# EAGLE schematic atmel_midi_clock (EAGLE 7.1.0)
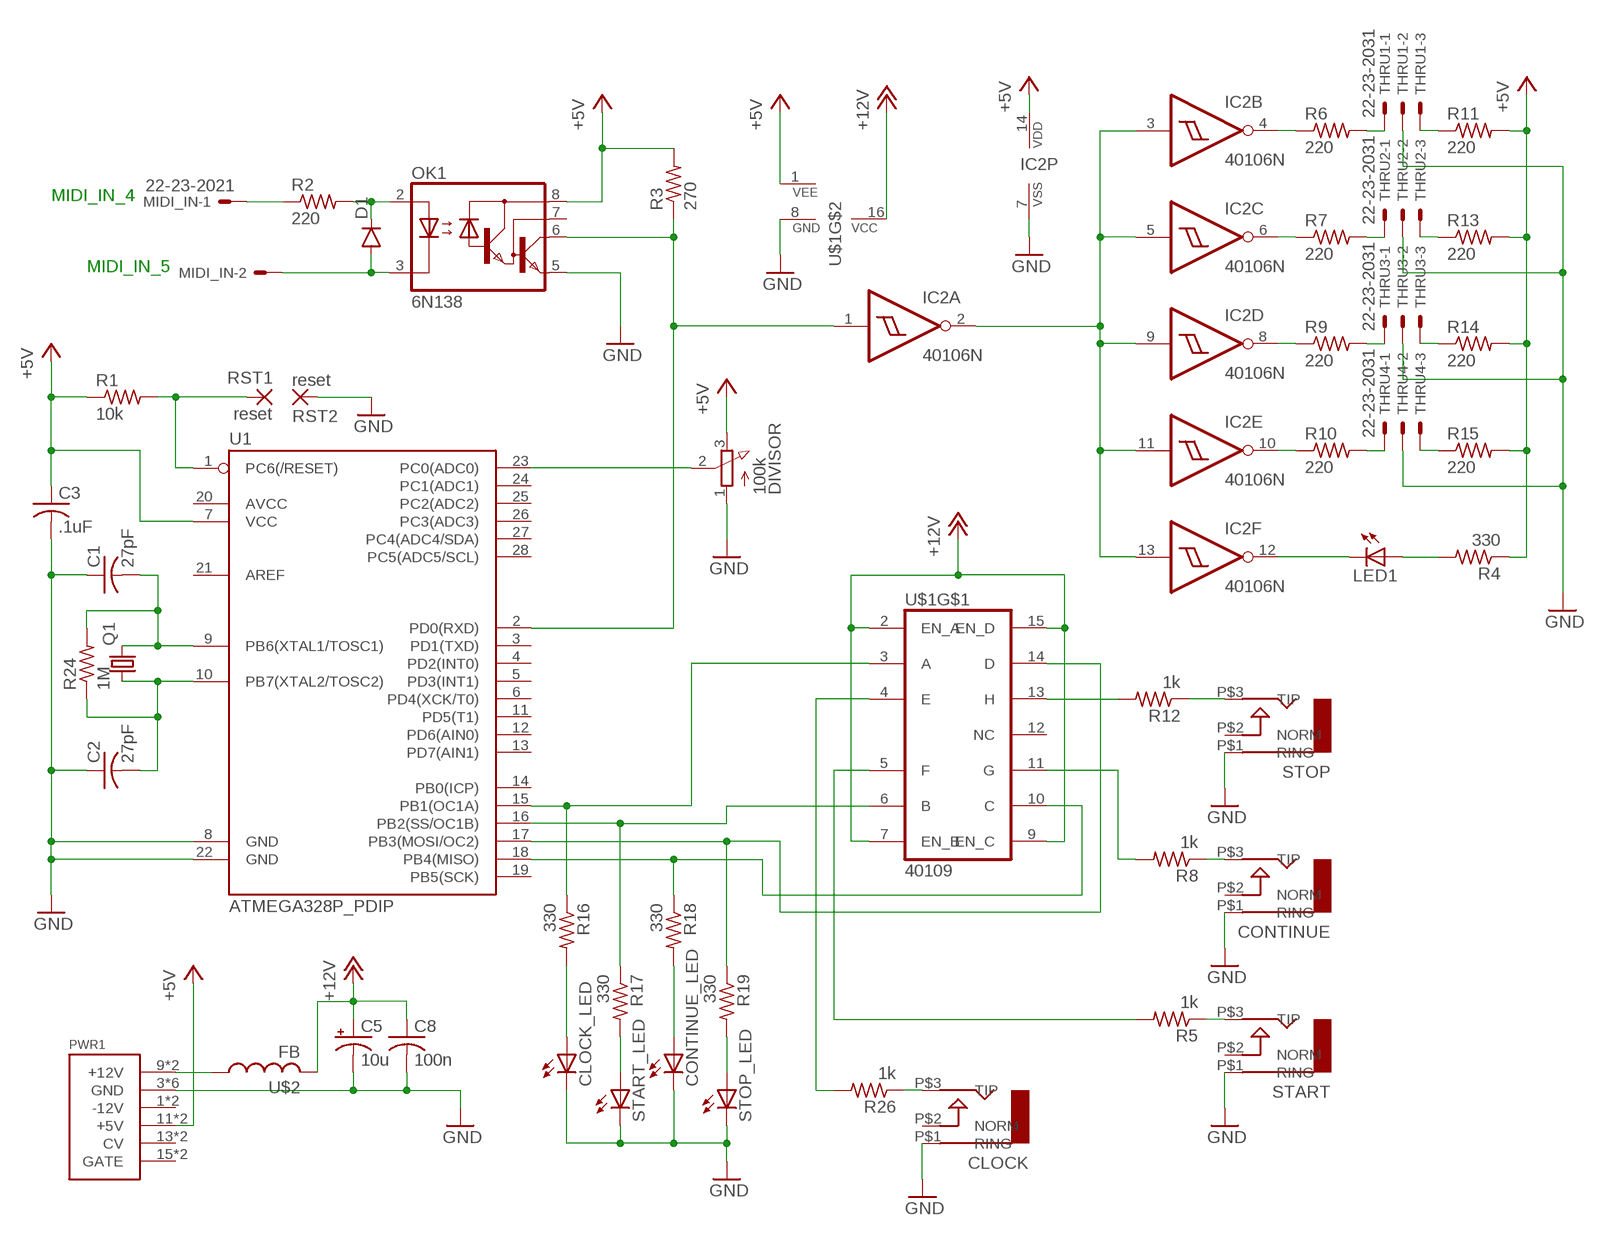
[diagram p0: schematic, sheet 1]

## Parts
C1  27pF  C-US025-040X050  [C025-040X050]
C2  27pF  C-US025-040X050  [C025-040X050]
C3  .1uF  C-US050-024X044  [C050-024X044]
C5  10u  CPOL-USB45181A  [B45181A]
C8  100n  C-US050-024X044  [C050-024X044]
CLOCK  AUDIO-JACK  [ERTHENVAR-JACK-90DEG]
CLOCK_LED  LED5MM  [LED5MM]
CONTINUE  AUDIO-JACK  [ERTHENVAR-JACK-90DEG]
CONTINUE_LED  LED5MM  [LED5MM]
D1  DIODE1N4148  [DIODE-1N4148]
DIVISOR  100k  3RP/1610N  [3RP/1610N]
IC2  40106N  [DIL14]
LED1  LED5MM  [LED5MM]
MIDI_IN  22-23-2021  [22-23-2021]
OK1  6N138  [DIL08]
PWR1  POWER  [POWER_16]
Q1  CRYSTALHC49S  [HC49/S]
R1  10k  R-US_0207/10  [0207/10]
R2  220  R-US_0207/10  [0207/10]
R3  270  R-US_0207/10  [0207/10]
R4  330  R-US_0207/10  [0207/10]
R5  1k  R-US_0207/10  [0207/10]
R6  220  R-US_0207/10  [0207/10]
R7  220  R-US_0207/10  [0207/10]
R8  1k  R-US_0207/10  [0207/10]
R9  220  R-US_0207/10  [0207/10]
R10  220  R-US_0207/10  [0207/10]
R11  220  R-US_0207/10  [0207/10]
R12  1k  R-US_0207/10  [0207/10]
R13  220  R-US_0207/10  [0207/10]
R14  220  R-US_0207/10  [0207/10]
R15  220  R-US_0207/10  [0207/10]
R16  330  R-US_0207/10  [0207/10]
R17  330  R-US_0207/10  [0207/10]
R18  330  R-US_0207/10  [0207/10]
R19  330  R-US_0207/10  [0207/10]
R24  1M  R-US_0207/10  [0207/10]
R26  1k  R-US_0207/10  [0207/10]
RST1  reset  2,54/0,9  [2,54/0,9]
RST2  reset  2,54/0,9  [2,54/0,9]
START  AUDIO-JACK  [ERTHENVAR-JACK-90DEG]
START_LED  LED5MM  [LED5MM]
STOP  AUDIO-JACK  [ERTHENVAR-JACK-90DEG]
STOP_LED  LED5MM  [LED5MM]
THRU1  22-23-2031  [22-23-2031]
THRU2  22-23-2031  [22-23-2031]
THRU3  22-23-2031  [22-23-2031]
THRU4  22-23-2031  [22-23-2031]
U1  ATMEGA328P_PDIP  [DIL28-3]
U$1  40109  [DIL16]
U$2  FB  [FB]

## Nets
+5V: C3.1 DIVISOR.3(E) IC2.14(P:VDD) OK1.8(VCC) PWR1.11(+5V) PWR1.12(+5V) R1.1 R3.2 R4.1 R11.2 R13.2 R14.2 R15.2 U1.7(VCC) U$1.1(VEE)
+12V: C5.+ C8.1 U$1.2(EN_A) U$1.7(EN_B) U$1.9(EN_C) U$1.15(EN_D) U$1.16(VCC) U$2.P$2
GND: C1.1 C2.1 C3.2 C5.- C8.2 CLOCK.P$1(RING) CLOCK_LED.K(C) CONTINUE.P$1(RING) CONTINUE_LED.K(C) DIVISOR.1(A) IC2.7(P:VSS) OK1.5(GND) PWR1.3(GND) PWR1.4(GND) PWR1.5(GND) PWR1.6(GND) PWR1.7(GND) PWR1.8(GND) RST2.1(P) START.P$1(RING) START_LED.K(C) STOP.P$1(RING) STOP_LED.K(C) THRU1.2 THRU2.2 THRU3.2 THRU4.2 U1.8(GND) U1.22(GND) U$1.8(GND)
N$1: R18.1 U1.18(PB4(MISO)) U$1.10(C)
N$2: R5.1 START.P$3(TIP)
N$3: D1.A MIDI_IN.2 OK1.3(C)
N$4: C1.2 Q1.2 R24.2 U1.9(PB6(XTAL1/TOSC1))
N$5: C2.2 Q1.1 R24.1 U1.10(PB7(XTAL2/TOSC2))
N$6: R19.1 U1.17(PB3(MOSI/OC2)) U$1.14(D)
N$7: D1.C OK1.2(A) R2.2
N$8: MIDI_IN.1 R2.1
N$9: R16.1 U1.15(PB1(OC1A)) U$1.3(A)
N$10: R17.1 U1.16(PB2(SS/OC1B)) U$1.6(B)
N$11: PWR1.9(+12V) PWR1.10(+12V) U$2.P$1
N$12: R5.2 U$1.5(F)
N$13: CONTINUE.P$3(TIP) R8.1
N$14: R26.2 U$1.4(E)
N$15: R12.2 U$1.13(H)
N$16: R8.2 U$1.11(G)
N$17: IC2.2(A:O) IC2.3(B:I) IC2.5(C:I) IC2.9(D:I) IC2.11(E:I) IC2.13(F:I)
N$18: R12.1 STOP.P$3(TIP)
N$19: DIVISOR.2(S) U1.23(PC0(ADC0))
N$20: IC2.12(F:O) LED1.K(C)
N$21: LED1.A R4.2
N$22: IC2.4(B:O) R6.1
N$23: IC2.6(C:O) R7.1
N$24: IC2.8(D:O) R9.1
N$25: IC2.10(E:O) R10.1
N$26: R6.2 THRU1.1
N$27: R7.2 THRU2.1
N$28: R9.2 THRU3.1
N$30: IC2.1(A:I) OK1.6(VO) R3.1 U1.2(PD0(RXD))
N$31: CLOCK.P$3(TIP) R26.1
N$32: R10.2 THRU4.1
N$33: R11.1 THRU1.3
N$34: R13.1 THRU2.3
N$35: R14.1 THRU3.3
N$36: R15.1 THRU4.3
N$37: R17.2 START_LED.A
N$38: CLOCK_LED.A R16.2
N$39: CONTINUE_LED.A R18.2
N$40: R19.2 STOP_LED.A
N$43: R1.2 RST1.1(P) U1.1(PC6(/RESET))
Unconnected: CLOCK.P$2(NORM) CONTINUE.P$2(NORM) OK1.7(VB) PWR1.1(-12V) PWR1.2(-12V) PWR1.13(CV) PWR1.14(CV) PWR1.15(GATE) PWR1.16(GATE) START.P$2(NORM) STOP.P$2(NORM) U1.3(PD1(TXD)) U1.4(PD2(INT0)) U1.5(PD3(INT1)) U1.6(PD4(XCK/T0)) U1.11(PD5(T1)) U1.12(PD6(AIN0)) U1.13(PD7(AIN1)) U1.14(PB0(ICP)) U1.19(PB5(SCK)) U1.20(AVCC) U1.21(AREF) U1.24(PC1(ADC1)) U1.25(PC2(ADC2)) U1.26(PC3(ADC3)) U1.27(PC4(ADC4/SDA)) U1.28(PC5(ADC5/SCL)) U$1.12(NC)

## Notes on the sheet
- MIDI_IN_4
- MIDI_IN_5

## Library data of the parts
C1-C3 C8 = rcl:C-US: CAPACITOR, American symbol
C5 = rcl:CPOL-US: POLARIZED CAPACITOR, American symbol
CLOCK CONTINUE START STOP = erthenvar:AUDIO-JACK: Switching Mono 3.5mm Audio Jack from Erthenvar.
CLOCK_LED CONTINUE_LED LED1 START_LED STOP_LED = led:LED: LED OSRAM: - CHIPLED LG R971, LG N971, LY N971, LG Q971, LY Q971, LO R971, LY R971 LH N974, LH R974 LS Q976, LO Q976, LY Q976 LO Q996 - Hyper CHIPLED LW Q18S LB Q993, LB Q99A, LB R99A - SideLED LS A670, LO A670, LY A670, LG A670, LP A670 LB A673, LV A673, LT A673, LW A673 LH A674 LY A675 LS A676, LA A676, LO A676, LY A676, LW A676 LS A679, LY A679, LG A679 - Hyper Micro SIDELED® LS Y876, LA Y876, LO Y876, LY Y876 LT Y87S - SmartLED LW L88C, LW L88S LB L89C, LB L89S, LG L890 LS L89K, LO L89K, LY L89K LS L896, LA L896, LO L896, LY L896 - TOPLED LS T670, LO T670, LY T670, LG T670, LP T670 LSG T670, LSP T670, LSY T670, LOP T670, LYG T670 LG T671, LOG T671, LSG T671 LB T673, LV T673, LT T673, LW T673 LH T674 LS T676, LA T676, LO T676, LY T676, LB T676, LH T676, LSB T676, LW T676 LB T67C, LV T67C, LT T67C, LS T67K, LO T67K, LY T67K, LW E67C LS E67B, LA E67B, LO E67B, LY E67B, LB E67C, LV E67C, LT E67C LW T67C LS T679, LY T679, LG T679 LS T770, LO T770, LY T770, LG T770, LP T770 LB T773, LV T773, LT T773, LW T773 LH T774 LS E675, LA E675, LY E675, LS T675 LS T776, LA T776, LO T776, LY T776, LB T776 LHGB T686 LT T68C, LB T68C - Hyper Mini TOPLED® LB M676 - Mini TOPLED Santana® LG M470 LS M47K, LO M47K, LY M47K Source: http://www.osram.convergy.de LUXEON: - LUMILED® LXK2-PW12-R00, LXK2-PW12-S00, LXK2-PW14-U00, LXK2-PW14-V00 LXK2-PM12-R00, LXK2-PM12-S00, LXK2-PM14-U00 LXK2-PE12-Q00, LXK2-PE12-R00, LXK2-PE12-S00, LXK2-PE14-T00, LXK2-PE14-U00 LXK2-PB12-K00, LXK2-PB12-L00, LXK2-PB12-M00, LXK2-PB14-N00, LXK2-PB14-P00, LXK2-PB14-Q00 LXK2-PR12-L00, LXK2-PR12-M00, LXK2-PR14-Q00, LXK2-PR14-R00 LXK2-PD12-Q00, LXK2-PD12-R00, LXK2-PD12-S00 LXK2-PH12-R00, LXK2-PH12-S00 LXK2-PL12-P00, LXK2-PL12-Q00, LXK2-PL12-R00 Source: www.luxeon.com KINGBRIGHT: KA-3528ASYC Source: www.kingbright.com
D1 = SparkFun-DiscreteSemi:DIODE: Diode These are standard reverse protection diodes and small signal diodes. SMA package can handle up to about 1A. SOD-323 can handle about 200mA. What the SOD-323 package when ordering, there are some mfgs out there that are 5-pin packages.
DIVISOR = pot:3RP/1610N: 16mm Potentiometer one level Source: http://www.alphapotentiometers.net/html/16mm_pot_2.html
IC2 = 40xx:40106: Hex SCHMITT TRIGGER
MIDI_IN = con-molex:22-23-2021: .100" (2.54mm) Center Header - 2 Pin; MF: MOLEX; MPN: 22-23-2021; OC_FARNELL: 1462926; OC_NEWARK: 25C3832
OK1 = optocoupler:6N138: MOTOROLA OPTO COUPLER; MF: VISHAY/TELEFUNKEN; MPN: 6N138; OC_FARNELL: 9860150; OC_NEWARK: 35K5294
PWR1 = eurorack:POWER
Q1 = crystal:CRYSTAL: CRYSTAL; OC_FARNELL: 1667008; OC_NEWARK: unknown
R1-R19 R24 R26 = rcl:R-US_: RESISTOR, American symbol
RST1 RST2 = wirepad:2,54/0,9: THROUGH-HOLE PAD
THRU1-THRU4 = con-molex:22-23-2031: .100" (2.54mm) Center Header - 3 Pin; MF: MOLEX; MPN: 22-23-2031; OC_FARNELL: 1462950; OC_NEWARK: 30C0862
U1 = SparkFun-DigitalIC:ATMEGA328P_PDIP: uC used in the Arduino 32kb flash, 1k EEPROM, 2k SRAM This is the through-hole version of this chip.
U$1 = 40xx:40109
U$2 = adafruit:FB: Ferrite bead Digikey #P9821BK-ND

## Net classes
1 GND: width 1.016 mm, drill 1.016 mm, clearance 0.508 mm